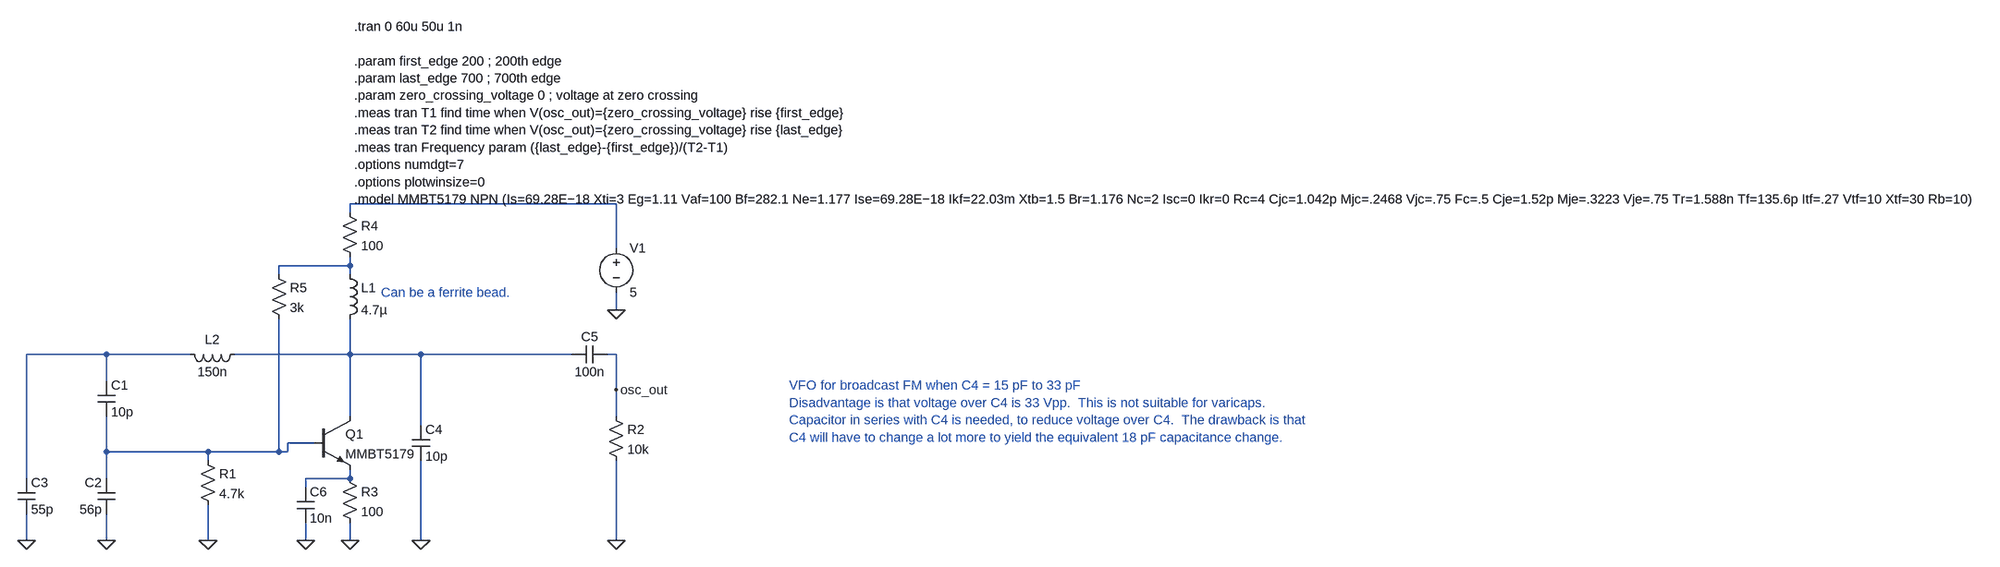
[diagram p0: schematic design4.asc]
design4.asc, the LTspice schematic file:
Version 4
SHEET 1 3428 680
WIRE 640 -32 160 -32
WIRE 160 -16 160 -32
WIRE 640 48 640 -32
WIRE 160 80 160 64
WIRE 160 80 32 80
WIRE 32 96 32 80
WIRE 160 96 160 80
WIRE 640 160 640 128
WIRE -384 240 -528 240
WIRE -128 240 -384 240
WIRE 160 240 160 176
WIRE 160 240 -48 240
WIRE 288 240 160 240
WIRE 560 240 288 240
WIRE 640 240 624 240
WIRE -384 288 -384 240
WIRE 640 304 640 240
WIRE 160 352 160 240
WIRE 640 352 640 304
WIRE 288 368 288 240
WIRE 96 400 48 400
WIRE -384 416 -384 352
WIRE -96 416 -384 416
WIRE 32 416 32 176
WIRE 32 416 -96 416
WIRE 48 416 48 400
WIRE 48 416 32 416
WIRE -96 432 -96 416
WIRE -528 464 -528 240
WIRE -384 464 -384 416
WIRE 160 464 160 448
WIRE 160 464 80 464
WIRE 80 480 80 464
WIRE -528 576 -528 528
WIRE -384 576 -384 528
WIRE -96 576 -96 512
WIRE 80 576 80 544
WIRE 160 576 160 544
WIRE 288 576 288 432
WIRE 640 576 640 432
FLAG 640 160 0
FLAG -528 576 0
FLAG -384 576 0
FLAG 160 576 0
FLAG -96 576 0
FLAG 288 576 0
FLAG 640 576 0
FLAG 640 304 osc_out
FLAG 80 576 0
DATAFLAG -80 416 ""
SYMBOL ind 144 80 R0
SYMATTR InstName L1
SYMATTR Value 4.7µ
SYMATTR SpiceLine Rser=1m
SYMBOL res -112 416 R0
SYMATTR InstName R1
SYMATTR Value 4.7k
SYMBOL cap -400 288 R0
SYMATTR InstName C1
SYMATTR Value 10p
SYMBOL cap -368 528 R180
WINDOW 0 24 56 Left 2
WINDOW 3 24 8 Left 2
SYMATTR InstName C2
SYMATTR Value 56p
SYMBOL cap -544 464 R0
SYMATTR InstName C3
SYMATTR Value 55p
SYMATTR SpiceLine Rpar=1meg
SYMBOL ind -32 224 R90
WINDOW 0 5 56 VBottom 2
WINDOW 3 32 56 VTop 2
SYMATTR InstName L2
SYMATTR Value 150n
SYMATTR SpiceLine Rser=0.1
SYMBOL voltage 640 32 R0
WINDOW 123 0 0 Left 0
WINDOW 39 0 0 Left 0
SYMATTR InstName V1
SYMATTR Value 5
SYMBOL cap 272 368 R0
SYMATTR InstName C4
SYMATTR Value 10p
SYMBOL res 624 336 R0
SYMATTR InstName R2
SYMATTR Value 10k
SYMBOL cap 624 224 R90
WINDOW 0 0 32 VBottom 2
WINDOW 3 32 32 VTop 2
SYMATTR InstName C5
SYMATTR Value 100n
SYMBOL res 144 448 R0
SYMATTR InstName R3
SYMATTR Value 100
SYMBOL cap 64 480 R0
SYMATTR InstName C6
SYMATTR Value 10n
SYMBOL npn 96 352 R0
SYMATTR InstName Q1
SYMATTR Value MMBT5179
SYMBOL res 144 -32 R0
SYMATTR InstName R4
SYMATTR Value 100
SYMBOL res 16 80 R0
SYMATTR InstName R5
SYMATTR Value 3k
TEXT 168 -352 Left 2 !.tran 0 60u 50u 1n\n \n.param first_edge 200 ; 200th edge\n.param last_edge 700 ; 700th edge\n.param zero_crossing_voltage 0 ; voltage at zero crossing\n.meas tran T1 find time when V(osc_out)={zero_crossing_voltage} rise {first_edge}\n.meas tran T2 find time when V(osc_out)={zero_crossing_voltage} rise {last_edge}\n.meas tran Frequency param ({last_edge}-{first_edge})/(T2-T1)\n.options numdgt=7\n.options plotwinsize=0\n.model MMBT5179 NPN (Is=69.28E−18 Xti=3 Eg=1.11 Vaf=100 Bf=282.1 Ne=1.177 Ise=69.28E−18 Ikf=22.03m Xtb=1.5 Br=1.176 Nc=2 Isc=0 Ikr=0 Rc=4 Cjc=1.042p Mjc=.2468 Vjc=.75 Fc=.5 Cje=1.52p Mje=.3223 Vje=.75 Tr=1.588n Tf=135.6p Itf=.27 Vtf=10 Xtf=30 Rb=10)
TEXT 952 296 Left 2 ;VFO for broadcast FM when C4 = 15 pF to 33 pF\nDisadvantage is that voltage over C4 is 33 Vpp.  This is not suitable for varicaps.\nCapacitor in series with C4 is needed, to reduce voltage over C4.  The drawback is that\nC4 will have to change a lot more to yield the equivalent 18 pF capacitance change.
TEXT 216 128 Left 2 ;Can be a ferrite bead.

The netlist it stands for:
* design4.asc
L1 N002 N004 4.7µ Rser=1m
R1 N005 0 4.7k
C1 N003 N005 10p
C2 0 N005 56p
C3 N003 0 55p Rpar=1meg
L2 N004 N003 150n Rser=0.1
V1 N001 0 5
C4 N004 0 10p
R2 osc_out 0 10k
C5 osc_out N004 100n
R3 N006 0 100
C6 N006 0 10n
Q1 N004 N005 N006 0 MMBT5179
R4 N001 N002 100
R5 N002 N005 3k
.model NPN NPN
.model PNP PNP
.lib standard.bjt
.tran 0 60u 50u 1n
.param first_edge 200 ; 200th edge
.param last_edge 700 ; 700th edge
.param zero_crossing_voltage 0 ; voltage at zero crossing
.meas tran T1 find time when V(osc_out)={zero_crossing_voltage} rise {first_edge}
.meas tran T2 find time when V(osc_out)={zero_crossing_voltage} rise {last_edge}
.meas tran Frequency param ({last_edge}-{first_edge})/(T2-T1)
.options numdgt=7
.options plotwinsize=0
.model MMBT5179 NPN (Is=69.28E−18 Xti=3 Eg=1.11 Vaf=100 Bf=282.1 Ne=1.177 Ise=69.28E−18 Ikf=22.03m Xtb=1.5 Br=1.176 Nc=2 Isc=0 Ikr=0 Rc=4 Cjc=1.042p Mjc=.2468 Vjc=.75 Fc=.5 Cje=1.52p Mje=.3223 Vje=.75 Tr=1.588n Tf=135.6p Itf=.27 Vtf=10 Xtf=30 Rb=10)
* VFO for broadcast FM when C4 = 15 pF to 33 pF
* Disadvantage is that voltage over C4 is 33 Vpp.  This is not suitable for varicaps.
* Capacitor in series with C4 is needed, to reduce voltage over C4.  The drawback is that
* C4 will have to change a lot more to yield the equivalent 18 pF capacitance change.
* Can be a ferrite bead.
.backanno
.end